# EAGLE design board (EAGLE 9.1.3)
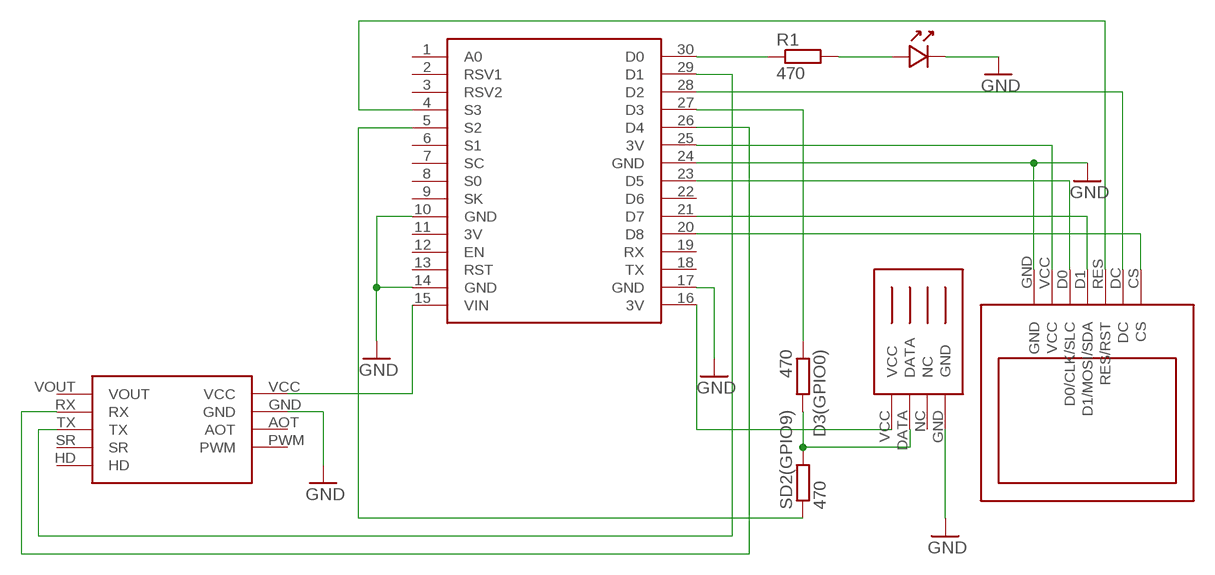
[diagram p0: schematic, sheet 1]

## Parts
D3(GPIO0)  470  R-EU_M1206  [M1206]
R1  470  R-EU_M1206  [M1206]
SD2(GPIO9)  470  R-EU_M1206  [M1206]
U$1  NODEMCUV3  [NODEMCU_V3]
U$2  DHT11DEF  [DHT11]
U$3  MH_Z19BDEF  [MH_Z19B]
U$4  OLED_1.3_V2.0DEF  [OLED_1.3_V2.0]
U$6  LED_3MLED3M_3D  [LEDRD254W60D300H500B]

## Nets
GND: U$1.10(GND) U$1.14(GND) U$1.17(GND) U$1.24(GND) U$2.GND U$3.GND U$4.GND U$6.2(K)
N$1: R1.1 U$1.30(D0)
N$2: D3(GPIO0).2 SD2(GPIO9).2 U$2.DATA
N$3: U$1.4(S3) U$4.RES(RES/RST)
N$4: R1.2 U$6.1(A)
N$5: U$1.20(D8) U$4.CS
N$6: U$1.28(D2) U$4.DC
N$7: U$1.21(D7) U$4.D1(D1/MOSI/SDA)
N$8: U$1.23(D5) U$4.D0(D0/CLK/SLC)
N$9: U$1.15(VIN) U$3.VCC
N$10: U$1.26(D4) U$3.RX
N$11: U$1.29(D1) U$3.TX
N$12: U$1.16(3V) U$2.VCC
N$13: U$1.25(3V) U$4.VCC
N$14: SD2(GPIO9).1 U$1.5(S2)
N$15: D3(GPIO0).1 U$1.27(D3)
Unconnected: U$1.1(A0) U$1.2(RSV1) U$1.3(RSV2) U$1.6(S1) U$1.7(SC) U$1.8(S0) U$1.9(SK) U$1.12(EN) U$1.13(RST) U$1.18(TX) U$1.19(RX) U$1.22(D6) U$2.NC U$3.AOT U$3.HD U$3.PWM U$3.SR U$3.VOUT

## Power pins joined to a net without a drawn wire
3V: U$1.11(3V)

## Library data of the parts
D3(GPIO0) R1 SD2(GPIO9) = resistor:R-EU_: RESISTOR, European symbol
U$1 = nodemcu:NODEMCU
U$2 = nodemcu:DHT11
U$3 = nodemcu:MH_Z19B
U$4 = nodemcu:OLED_1.3_V2.0
U$6 = nodemcu:LED_3M

## Board
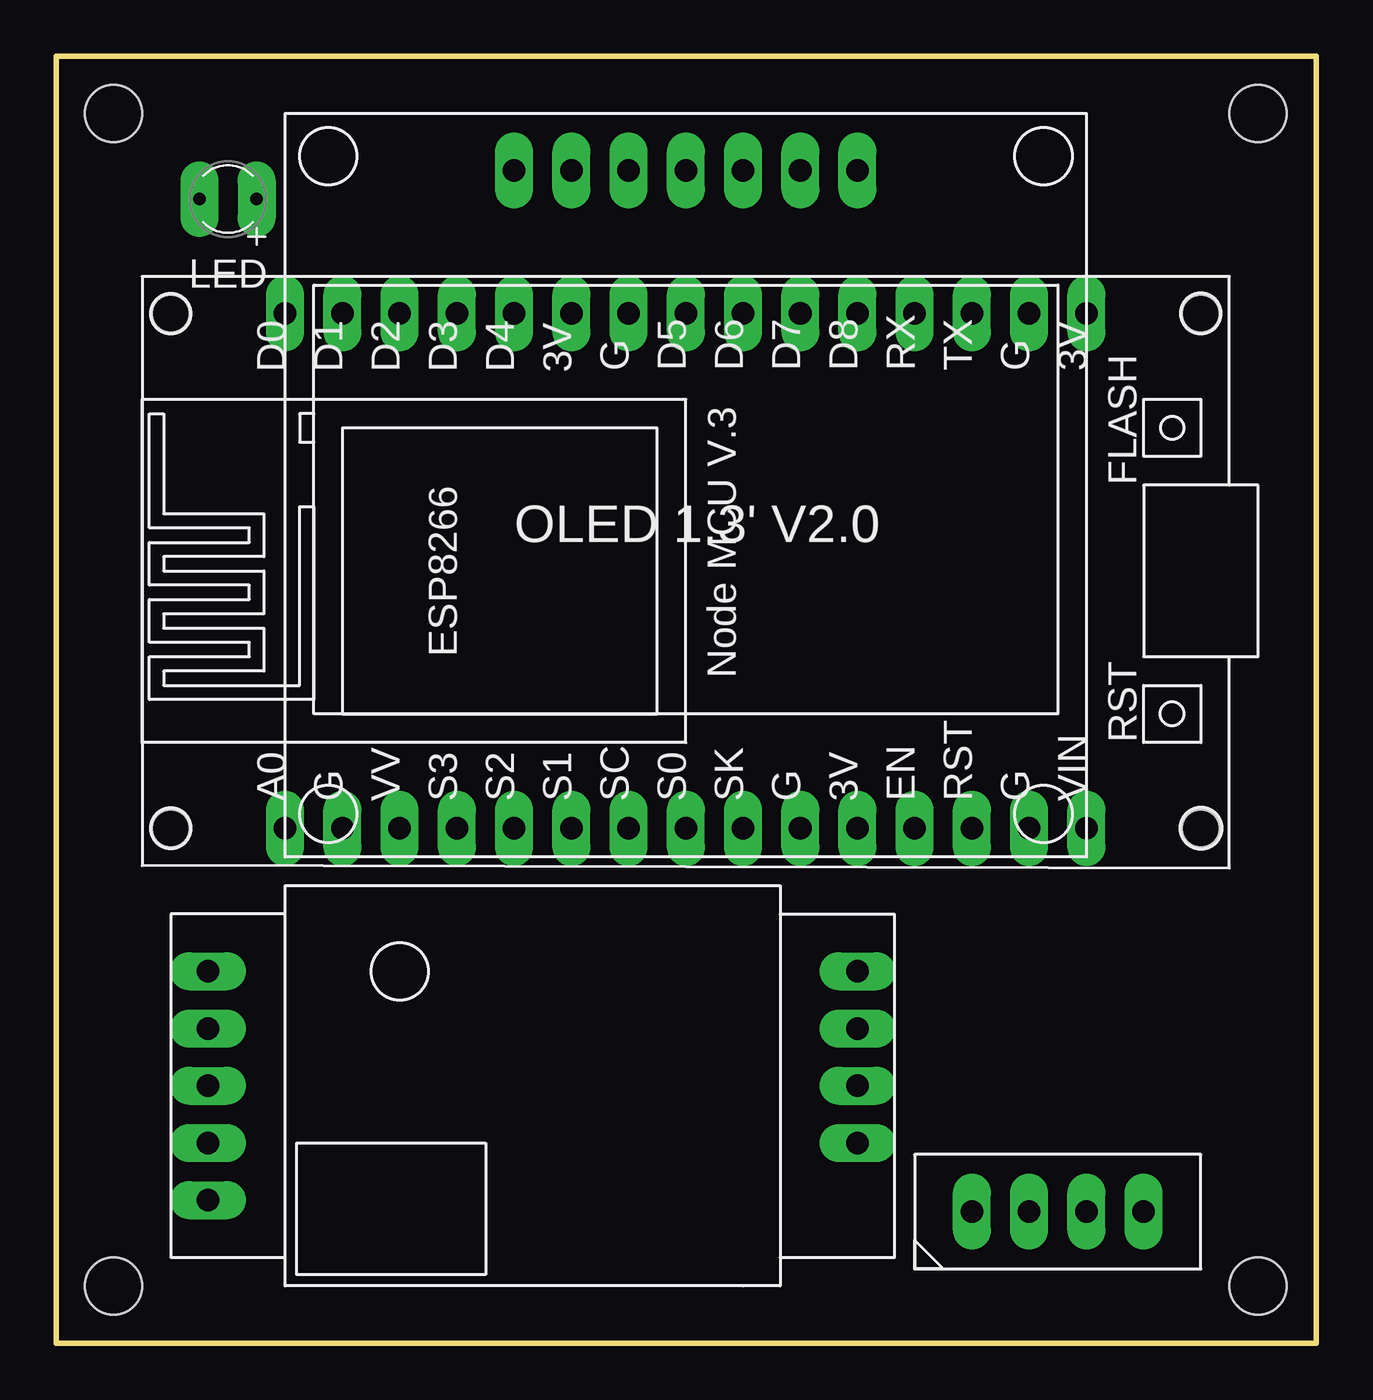
[diagram p1: board, top side]
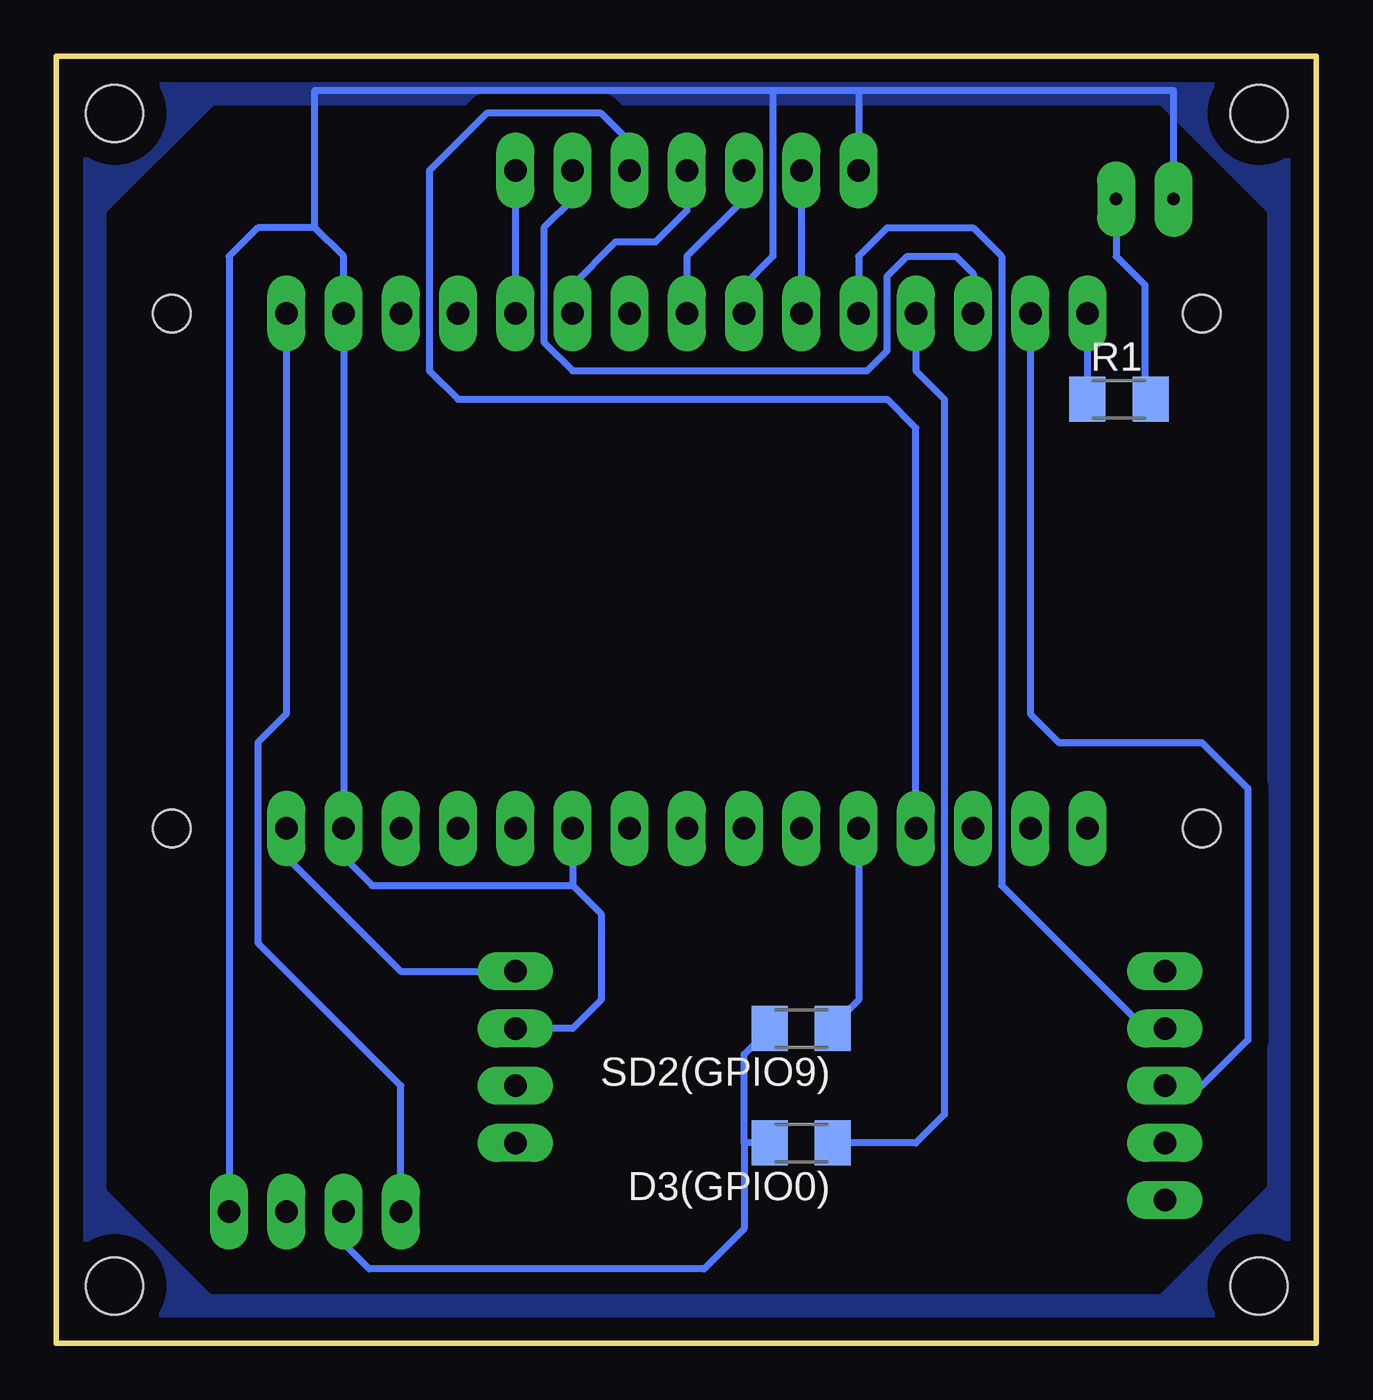
[diagram p2: board, bottom side, seen from below]

Size 55.93 x 57.14 mm. Coordinates in mm from the lower left corner, seen from the top.
Outline: 0,0 55.93,0 55.93,57.14 0,57.14 0,0
Copper layers (1*16): Top 0.035mm / dielectric 1.5mm / Bottom 0.035mm
Design rules "default": minimum track width 6mil, minimum drill 0.35mm, track to track 6mil, track to pad 6mil, pad to pad 6mil, via to via 6mil, smd to smd 6mil, copper to edge 40mil, drill to drill 6mil, minimum pad ring 10mil, minimum via ring 8mil, stop-mask expansion 4mil, vias tented up to drill 0mil, thermal gap 10mil
Holes 2.54 mm at 2.54,2.54 53.34,2.54 53.34,54.61 2.54,54.61

### Footprints (pad centres in the part's own frame; a part is rotated, then mirrored left to right if it is on the bottom)
M1206 = smd 1.6 x 2: 1 -1.4,0; 2 1.4,0
NODEMCU_V3 = drill 1 pad 1.676 long: 1 -11.43,17.78; 2 -11.43,15.24; 3 -11.43,12.7; 4 -11.43,10.16; 5 -11.43,7.62; 6 -11.43,5.08; 7 -11.43,2.54; 8 -11.43,0; 9 -11.43,-2.54; 10 -11.43,-5.08; 11 -11.43,-7.62; 12 -11.43,-10.16; 13 -11.43,-12.7; 14 -11.43,-15.24; 15 -11.43,-17.78; 16 11.43,-17.78; 17 11.43,-15.24; 18 11.43,-12.7; 19 11.43,-10.16; 20 11.43,-7.62; 21 11.43,-5.08; 22 11.43,-2.54; 23 11.43,0; 24 11.43,2.54; 25 11.43,5.08; 26 11.43,7.62; 27 11.43,10.16; 28 11.43,12.7; 29 11.43,15.24; 30 11.43,17.78 | hole 1.676: 11.43,-22.86; -11.43,-22.86; -11.43,22.86; 11.43,22.86
DHT11 = drill 1 pad 1.676 long: DATA 0,0; GND 5.08,0; NC 2.54,0; VCC -2.54,0
MH_Z19B = drill 1 pad 1.676 long: AOT 13.97,0; GND 13.97,2.54; HD -14.859,-5.08; PWM 13.97,-2.54; RX -14.859,2.54; SR -14.859,-2.54; TX -14.859,0; VCC 13.97,5.08; VOUT -14.859,5.08
OLED_1.3_V2.0 = drill 1 pad 1.676 long: CS 7.62,0; D0 -2.54,0; D1 0,0; DC 5.08,0; GND -7.62,0; RES 2.54,0; VCC -5.08,0
LEDRD254W60D300H500B = drill 0.55 pad 1.676 long: 1 -1.27,0; 2 1.27,0

### Placement (x,y rotation side)
D3(GPIO0)  22.86,8.89 180 bottom
R1  8.76,41.91 0 bottom
SD2(GPIO9)  22.86,13.97 180 bottom
U$1  27.94,34.29 90 top
U$2  43.18,5.84 0 top
U$3  21.59,11.43 0 top
U$4  27.94,52.07 0 top
U$6  7.62,50.8 180 top

### Tracks (layer width: path | path; a pad name or v marks a point on that pad's centre or on a via)
CUT
  cutout Bottom: 11.68,54.86 6.99,54.86 2.29,50.16 2.29,6.99 6.99,2.29 49.02,2.29 53.59,6.86 53.59,50.16 48.9,54.86
GND
  Bottom 0.305: 44.45,49.53 43.18,48.26 U$1.17 U$1.14 43.18,21.59 41.91,20.32 33.02,20.32 | 44.45,49.53 46.99,49.53 48.26,48.26 U$2.GND | 33.02,20.32 31.75,19.05 31.75,15.24 33.02,13.97 U$3.GND | 44.45,49.53 44.45,55.63 24.13,55.63 | U$1.10 33.02,20.32 | 24.13,55.63 20.32,55.63 | 20.32,55.63 6.35,55.63 U$6.2 | U$1.24 25.4,46.99 24.13,48.26 24.13,55.63 | 20.32,55.63 U$4.GND
  pour Bottom (isolate 0.762): 0,57.15 54.61,57.15 54.61,0 0,0
N$1
  Bottom 0.305: R1.1 U$1.30
N$2
  Bottom 0.305: SD2(GPIO9).2 25.4,12.83 25.4,8.89 | D3(GPIO0).2 25.4,8.89 | 25.4,8.89 25.4,5.08 27.18,3.3 42.04,3.3 43.18,4.45 U$2.DATA
N$3
  Bottom 0.305: U$1.4 17.78,40.64 19.05,41.91 38.1,41.91 39.37,43.18 39.37,52.07 36.83,54.61 31.75,54.61 30.48,53.34 U$4.RES
N$4
  Bottom 0.305: R1.2 7.62,42.17 7.62,46.99 8.89,48.26 U$6.1
N$5
  Bottom 0.305: U$4.CS U$1.20
N$6
  Bottom 0.305: U$4.DC 33.02,50.8 34.29,49.53 34.29,44.45 33.02,43.18 19.94,43.18 19.05,44.07 19.05,47.37 18.16,48.26 16,48.26 15.24,47.5 U$1.28
N$7
  Bottom 0.305: U$1.21 33.02,46.99 31.11,48.9 29.34,48.9 27.94,50.29 U$4.D1
N$8
  Bottom 0.305: U$4.D0 25.4,50.8 27.94,48.26 U$1.23
N$9
  Bottom 0.305: U$1.15 45.72,21.59 40.64,16.51 U$3.VCC
N$10
  Bottom 0.305: U$1.26 20.32,48.26 19.05,49.53 15.24,49.53 13.97,48.26 13.97,20.32 7.62,13.97 U$3.RX
N$11
  Bottom 0.305: U$1.29 12.7,27.94 11.43,26.67 5.08,26.67 3.05,24.64 3.05,13.46 5.08,11.43 U$3.TX
N$12
  Bottom 0.305: U$1.16 45.72,27.94 46.99,26.67 46.99,17.78 40.64,11.43 U$2.VCC
N$13
  Bottom 0.305: U$4.VCC U$1.25
N$14
  Bottom 0.305: U$1.5 20.32,15.24 21.46,14.1 SD2(GPIO9).1
N$15
  Bottom 0.305: U$1.27 17.78,43.18 16.51,41.91 16.51,10.16 17.78,8.89 D3(GPIO0).1